# Altium schematic sheet Sheet_esp32_OPTO.SchDoc
size A3
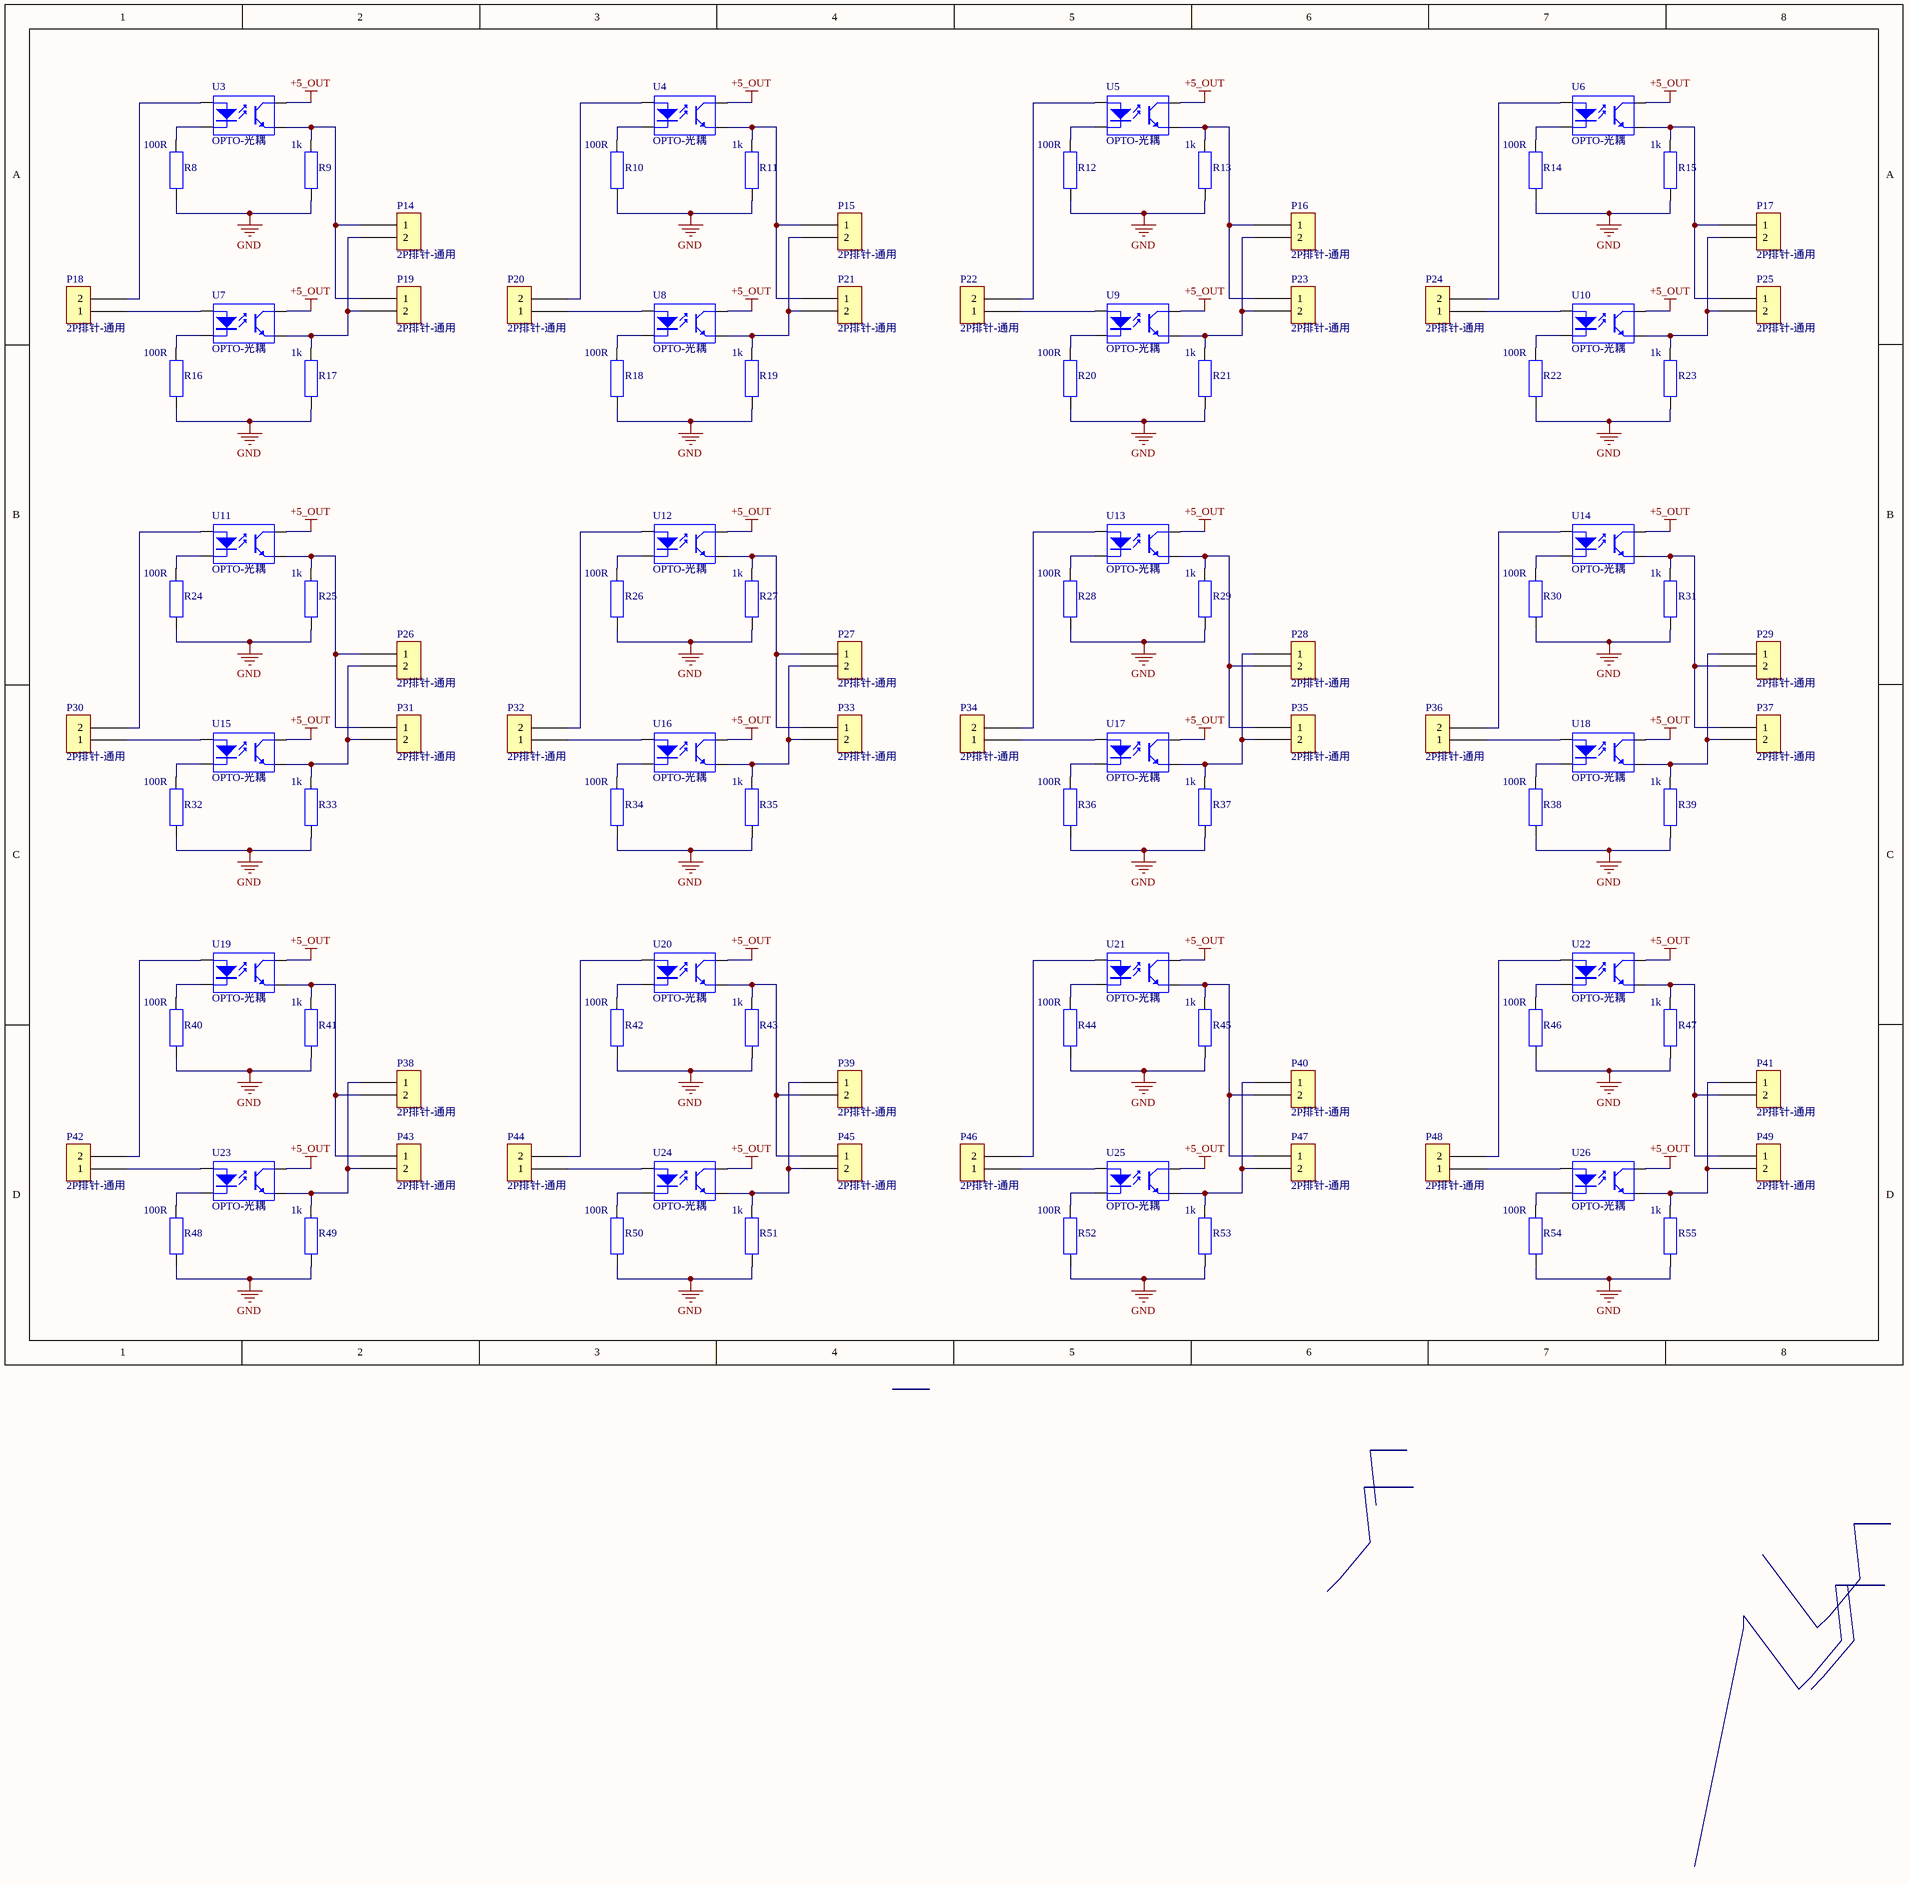
[diagram p0: Sheet_esp32_OPTO.SchDoc]

## Parts
P14  2P排针-通用  [2P-KF2EDGK插头]
P15  2P排针-通用  [2P-KF2EDGK插头]
P16  2P排针-通用  [2P-KF2EDGK插头]
P17  2P排针-通用  [2P-KF2EDGK插头]
P18  2P排针-通用  [2p排针-通用]
P19  2P排针-通用  [2p排针-通用]
P20  2P排针-通用  [2p排针-通用]
P21  2P排针-通用  [2p排针-通用]
P22  2P排针-通用  [2p排针-通用]
P23  2P排针-通用  [2p排针-通用]
P24  2P排针-通用  [2p排针-通用]
P25  2P排针-通用  [2p排针-通用]
P26  2P排针-通用  [2P-KF2EDGK插头]
P27  2P排针-通用  [2P-KF2EDGK插头]
P28  2P排针-通用  [2P-KF2EDGK插头]
P29  2P排针-通用  [2P-KF2EDGK插头]
P30  2P排针-通用  [2p排针-通用]
P31  2P排针-通用  [2p排针-通用]
P32  2P排针-通用  [2p排针-通用]
P33  2P排针-通用  [2p排针-通用]
P34  2P排针-通用  [2p排针-通用]
P35  2P排针-通用  [2p排针-通用]
P36  2P排针-通用  [2p排针-通用]
P37  2P排针-通用  [2p排针-通用]
P38  2P排针-通用  [2P-KF2EDGK插头]
P39  2P排针-通用  [2P-KF2EDGK插头]
P40  2P排针-通用  [2P-KF2EDGK插头]
P41  2P排针-通用  [2P-KF2EDGK插头]
P42  2P排针-通用  [2p排针-通用]
P43  2P排针-通用  [2p排针-通用]
P44  2P排针-通用  [2p排针-通用]
P45  2P排针-通用  [2p排针-通用]
P46  2P排针-通用  [2p排针-通用]
P47  2P排针-通用  [2p排针-通用]
P48  2P排针-通用  [2p排针-通用]
P49  2P排针-通用  [2p排针-通用]
R8  100R  [贴片0805-手工]
R9  1k  [贴片0805-手工]
R10  100R  [贴片0805-手工]
R11  1k  [贴片0805-手工]
R12  100R  [贴片0805-手工]
R13  1k  [贴片0805-手工]
R14  100R  [贴片0805-手工]
R15  1k  [贴片0805-手工]
R16  100R  [贴片0805-手工]
R17  1k  [贴片0805-手工]
R18  100R  [贴片0805-手工]
R19  1k  [贴片0805-手工]
R20  100R  [贴片0805-手工]
R21  1k  [贴片0805-手工]
R22  100R  [贴片0805-手工]
R23  1k  [贴片0805-手工]
R24  100R  [贴片0805-手工]
R25  1k  [贴片0805-手工]
R26  100R  [贴片0805-手工]
R27  1k  [贴片0805-手工]
R28  100R  [贴片0805-手工]
R29  1k  [贴片0805-手工]
R30  100R  [贴片0805-手工]
R31  1k  [贴片0805-手工]
R32  100R  [贴片0805-手工]
R33  1k  [贴片0805-手工]
R34  100R  [贴片0805-手工]
R35  1k  [贴片0805-手工]
R36  100R  [贴片0805-手工]
R37  1k  [贴片0805-手工]
R38  100R  [贴片0805-手工]
R39  1k  [贴片0805-手工]
R40  100R  [贴片0805-手工]
R41  1k  [贴片0805-手工]
R42  100R  [贴片0805-手工]
R43  1k  [贴片0805-手工]
R44  100R  [贴片0805-手工]
R45  1k  [贴片0805-手工]
R46  100R  [贴片0805-手工]
R47  1k  [贴片0805-手工]
R48  100R  [贴片0805-手工]
R49  1k  [贴片0805-手工]
R50  100R  [贴片0805-手工]
R51  1k  [贴片0805-手工]
R52  100R  [贴片0805-手工]
R53  1k  [贴片0805-手工]
R54  100R  [贴片0805-手工]
R55  1k  [贴片0805-手工]
U3  OPTO-光耦  [光耦直插]
U4  OPTO-光耦  [光耦直插]
U5  OPTO-光耦  [光耦直插]
U6  OPTO-光耦  [光耦直插]
U7  OPTO-光耦  [光耦直插]
U8  OPTO-光耦  [光耦直插]
U9  OPTO-光耦  [光耦直插]
U10  OPTO-光耦  [光耦直插]
U11  OPTO-光耦  [光耦直插]
U12  OPTO-光耦  [光耦直插]
U13  OPTO-光耦  [光耦直插]
U14  OPTO-光耦  [光耦直插]
U15  OPTO-光耦  [光耦直插]
U16  OPTO-光耦  [光耦直插]
U17  OPTO-光耦  [光耦直插]
U18  OPTO-光耦  [光耦直插]
U19  OPTO-光耦  [光耦直插]
U20  OPTO-光耦  [光耦直插]
U21  OPTO-光耦  [光耦直插]
U22  OPTO-光耦  [光耦直插]
U23  OPTO-光耦  [光耦直插]
U24  OPTO-光耦  [光耦直插]
U25  OPTO-光耦  [光耦直插]
U26  OPTO-光耦  [光耦直插]

## Nets
+5_OUT: U3.4(C) U4.4(C) U5.4(C) U6.4(C) U7.4(C) U8.4(C) U9.4(C) U10.4(C) U11.4(C) U12.4(C) U13.4(C) U14.4(C) U15.4(C) U16.4(C) U17.4(C) U18.4(C) U19.4(C) U20.4(C) U21.4(C) U22.4(C) U23.4(C) U24.4(C) U25.4(C) U26.4(C)
GND: R8.1 R9.1 R10.1 R11.1 R12.1 R13.1 R14.1 R15.1 R16.1 R17.1 R18.1 R19.1 R20.1 R21.1 R22.1 R23.1 R24.1 R25.1 R26.1 R27.1 R28.1 R29.1 R30.1 R31.1 R32.1 R33.1 R34.1 R35.1 R36.1 R37.1 R38.1 R39.1 R40.1 R41.1 R42.1 R43.1 R44.1 R45.1 R46.1 R47.1 R48.1 R49.1 R50.1 R51.1 R52.1 R53.1 R54.1 R55.1
NetP14_1: P14.1 P19.1 R9.2 U3.3(E)
NetP14_2: P14.2 P19.2 R17.2 U7.3(E)
NetP15_1: P15.1 P21.1 R11.2 U4.3(E)
NetP15_2: P15.2 P21.2 R19.2 U8.3(E)
NetP16_1: P16.1 P23.1 R13.2 U5.3(E)
NetP16_2: P16.2 P23.2 R21.2 U9.3(E)
NetP17_1: P17.1 P25.1 R15.2 U6.3(E)
NetP17_2: P17.2 P25.2 R23.2 U10.3(E)
NetP18_1: P18.1 U7.1(A)
NetP18_2: P18.2 U3.1(A)
NetP20_1: P20.1 U8.1(A)
NetP20_2: P20.2 U4.1(A)
NetP22_1: P22.1 U9.1(A)
NetP22_2: P22.2 U5.1(A)
NetP24_1: P24.1 U10.1(A)
NetP24_2: P24.2 U6.1(A)
NetP26_1: P26.1 P31.1 R25.2 U11.3(E)
NetP26_2: P26.2 P31.2 R33.2 U15.3(E)
NetP27_1: P27.1 P33.1 R27.2 U12.3(E)
NetP27_2: P27.2 P33.2 R35.2 U16.3(E)
NetP28_1: P28.1 P35.2 R37.2 U17.3(E)
NetP28_2: P28.2 P35.1 R29.2 U13.3(E)
NetP29_1: P29.1 P37.2 R39.2 U18.3(E)
NetP29_2: P29.2 P37.1 R31.2 U14.3(E)
NetP30_1: P30.1 U15.1(A)
NetP30_2: P30.2 U11.1(A)
NetP32_1: P32.1 U16.1(A)
NetP32_2: P32.2 U12.1(A)
NetP34_1: P34.1 U17.1(A)
NetP34_2: P34.2 U13.1(A)
NetP36_1: P36.1 U18.1(A)
NetP36_2: P36.2 U14.1(A)
NetP38_1: P38.1 P43.2 R49.2 U23.3(E)
NetP38_2: P38.2 P43.1 R41.2 U19.3(E)
NetP39_1: P39.1 P45.2 R51.2 U24.3(E)
NetP39_2: P39.2 P45.1 R43.2 U20.3(E)
NetP40_1: P40.1 P47.2 R53.2 U25.3(E)
NetP40_2: P40.2 P47.1 R45.2 U21.3(E)
NetP41_1: P41.1 P49.2 R55.2 U26.3(E)
NetP41_2: P41.2 P49.1 R47.2 U22.3(E)
NetP42_1: P42.1 U23.1(A)
NetP42_2: P42.2 U19.1(A)
NetP44_1: P44.1 U24.1(A)
NetP44_2: P44.2 U20.1(A)
NetP46_1: P46.1 U25.1(A)
NetP46_2: P46.2 U21.1(A)
NetP48_1: P48.1 U26.1(A)
NetP48_2: P48.2 U22.1(A)
NetR8_2: R8.2 U3.2(K)
NetR10_2: R10.2 U4.2(K)
NetR12_2: R12.2 U5.2(K)
NetR14_2: R14.2 U6.2(K)
NetR16_2: R16.2 U7.2(K)
NetR18_2: R18.2 U8.2(K)
NetR20_2: R20.2 U9.2(K)
NetR22_2: R22.2 U10.2(K)
NetR24_2: R24.2 U11.2(K)
NetR26_2: R26.2 U12.2(K)
NetR28_2: R28.2 U13.2(K)
NetR30_2: R30.2 U14.2(K)
NetR32_2: R32.2 U15.2(K)
NetR34_2: R34.2 U16.2(K)
NetR36_2: R36.2 U17.2(K)
NetR38_2: R38.2 U18.2(K)
NetR40_2: R40.2 U19.2(K)
NetR42_2: R42.2 U20.2(K)
NetR44_2: R44.2 U21.2(K)
NetR46_2: R46.2 U22.2(K)
NetR48_2: R48.2 U23.2(K)
NetR50_2: R50.2 U24.2(K)
NetR52_2: R52.2 U25.2(K)
NetR54_2: R54.2 U26.2(K)

## Library data of the parts
R8-R55 = 电阻 - 通用: Resistor; Published: 8-Jun-2000; LatestRevisionDate: 17-Jul-2002; LatestRevisionNote: Re-released for DXP Platform.; PackageReference: AXIAL-0.4; Publisher: Altium Limited; PackageDescription: Axial Device, Thru-Hole; 2 Leads; 0.4 in Pin Spacing
U3-U26 = OPTO-光耦: Optoisolator
P14-P49 = 2P排针-通用: LatestRevisionDate: 17-Jul-2002; LatestRevisionNote: Re-released for DXP Platform.; Publisher: Altium Limited